# Altium schematic sheet USB Full Speed.SchDoc
size A3; Company Name: Renesas Electronics America; CompanyURL: www.renesas.com; PageSetup: Record=PageOptions|CenterHorizontal=True|CenterVertical=True|PrintScale=1.00|XCorrection=1.00|YCorrection=1.00|PrintKind=1|BorderSize=5000000|LeftOffset=0|BottomOffset=0|Orientation=2|PaperLength=1000|PaperWidth=1000|Scale=100|PaperSource=7|PrintQuality=-4|MediaType=1|DitherType=10|PaperKind=A5 148x210mm|PrintScaleMode=1; ReleaseDate: 16.09.2025; Version: MP; SPICEModelCache: <root> / <DocumentId>FGGANMHQ</DocumentId> / </root>; SheetNumber: 4; SheetTotal: 18; VariantNumber: 0; DSheetNumber: 1
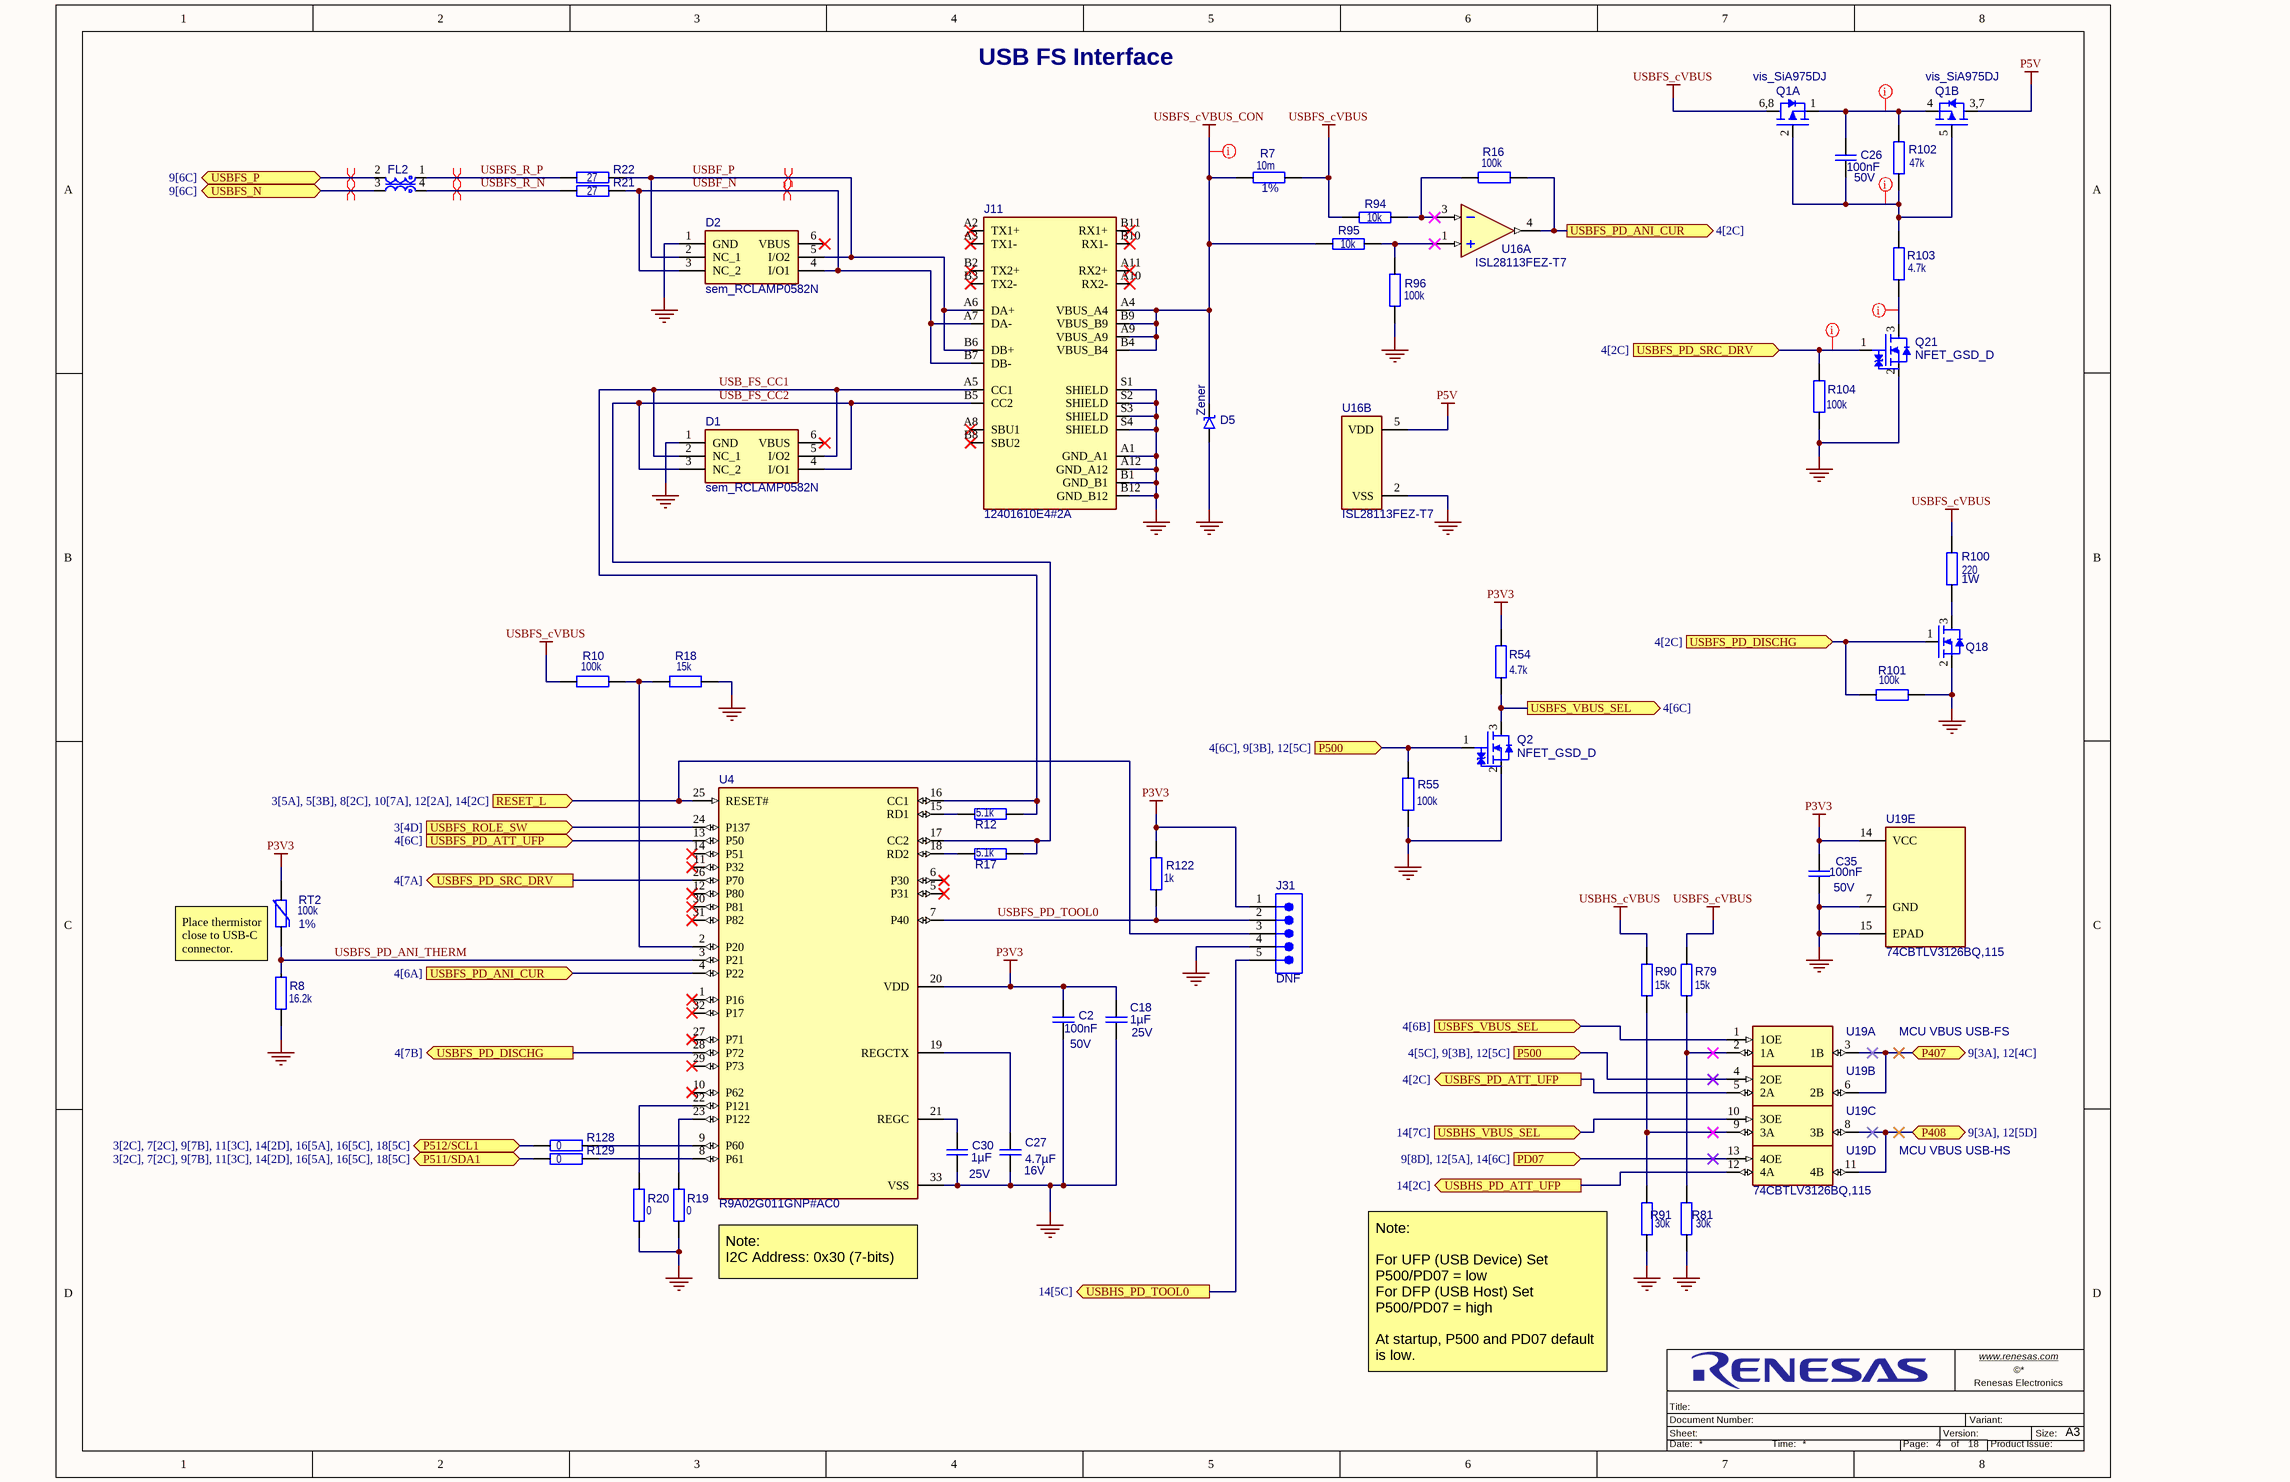
[diagram p0: USB Full Speed.SchDoc]

## Parts
C2  value 100nF  Operating Voltage Max: 50V  [C_EIA0402_0p55]  (hidden comment: Capacitor)
C18  value 1µF  Operating Voltage Max: 25V  [C_EIA0402_0p6]  (hidden comment: Capacitor)
C26  value 100nF  Operating Voltage Max: 50V  [C_EIA0402_0p55]  (hidden comment: Capacitor)
C27  value 4.7µF  Operating Voltage Max: 16V  [C_EIA0603_1p0]  (hidden comment: Capacitor)
C30  value 1µF  Operating Voltage Max: 25V  [C_EIA0402_0p6]  (hidden comment: Capacitor)
C35  value 100nF  Operating Voltage Max: 50V  [C_EIA0402_0p55]  (hidden comment: Capacitor)
D1  sem_RCLAMP0582N  [sem_SLP-6_SLP1210N6]
D2  sem_RCLAMP0582N  [sem_SLP-6_SLP1210N6]
D5  Zener  [sem_SGP-2_SGP1610N2]
FL2  CMC_1-2_4-3  [mur_EIA03025]  (value not drawn)
J11  12401610E4#2A  [amp_12401610E42A]
J31  CON_005  [wue_61300511121]  (value not drawn)
Q1  vis_SiA975DJ  [vis_SC70-6L_Dual]  (parts A,B of 2)
Q2  NFET_GSD_D  [roh_SOT-416FL_SC-89]
Q18  NFET_GSD  [ir_sot-23_3N]  (value not drawn)
Q21  NFET_GSD_D  [roh_SOT-416FL_SC-89]
R7  value 10m  Tolerance: 1%  [R_EIA0603]  (hidden comment: Resistor)
R8  value 16.2k  [R_EIA0402]  (hidden comment: Resistor)
R10  value 100k  [R_EIA0402]  (hidden comment: Resistor)
R12  value 5.1k  [R_EIA0402]  (hidden comment: Resistor)
R16  value 100k  [R_EIA0402]  (hidden comment: Resistor)
R17  value 5.1k  [R_EIA0402]  (hidden comment: Resistor)
R18  value 15k  [R_EIA0402]  (hidden comment: RC0402FR-0715KL)
R19  value 0  [R_EIA0402]  (hidden comment: Resistor)
R20  value 0  [R_EIA0402]  (hidden comment: Resistor)
R21  value 27  [R_EIA0402]  (hidden comment: Resistor)
R22  value 27  [R_EIA0402]  (hidden comment: Resistor)
R54  value 4.7k  [R_EIA0402]  (hidden comment: Resistor)
R55  value 100k  [R_EIA0402]  (hidden comment: Resistor)
R79  value 15k  [R_EIA0402]  (hidden comment: RC0402FR-0715KL)
R81  value 30k  [R_EIA0402]  (hidden comment: RC0402FR-0730KL)
R90  value 15k  [R_EIA0402]  (hidden comment: RC0402FR-0715KL)
R91  value 30k  [R_EIA0402]  (hidden comment: RC0402FR-0730KL)
R94  value 10k  [R_EIA0402]  (hidden comment: Resistor)
R95  value 10k  [R_EIA0402]  (hidden comment: Resistor)
R96  value 100k  [R_EIA0402]  (hidden comment: Resistor)
R100  value 220  Power: 1W  [R_EIA2512]  (hidden comment: Resistor)
R101  value 100k  [R_EIA0402]  (hidden comment: Resistor)
R102  value 47k  [R_EIA0402]  (hidden comment: Resistor)
R103  value 4.7k  [R_EIA0402]  (hidden comment: Resistor)
R104  value 100k  [R_EIA0402]  (hidden comment: Resistor)
R122  value 1k  [R_EIA0402]  (hidden comment: Resistor)
R128  value 0  [R_EIA0402]  (hidden comment: Resistor)
R129  value 0  [R_EIA0402]  (hidden comment: Resistor)
RT2  value 100k  Tolerance: 1%  [R_EIA0402]  (hidden comment: Thermistor)
U4  R9A02G011GNP#AC0  [ren_HVQFN-32_PVQN0032KG-A]
U16  ISL28113FEZ-T7  [ren_SC70-5_P5.049]  (parts A,B of 2)
U19  74CBTLV3126BQ,115  [nex_DHVQFN14_SOT-762-1_MO-241]  (value not drawn)  (parts A,B,C,D,E of 5)

## Ports
P407 (bidir, see 9[3A], 12[4C]), P408 (bidir, see 9[3A], 12[5D]), P500 (in, see 4[5C], 9[3B], 12[5C]), P500 (in, see 4[6C], 9[3B], 12[5C]), P511/SDA1 (bidir, see 3[2C], 7[2C], 9[7B], 11[3C], 14[2D], 16[5A], 16[5C], 18[5C]), P512/SCL1 (bidir, see 3[2C], 7[2C], 9[7B], 11[3C], 14[2D], 16[5A], 16[5C], 18[5C]), PD07 (in, see 9[8D], 12[5A], 14[6C]), RESET_L (in, see 3[5A], 5[3B], 8[2C], 10[7A], 12[2A], 14[2C]), USBFS_N (bidir, see 9[6C]), USBFS_P (bidir, see 9[6C]), USBFS_PD_ANI_CUR (in, see 4[6A]), USBFS_PD_ANI_CUR (out, see 4[2C]), USBFS_PD_ATT_UFP (in, see 4[6C]), USBFS_PD_ATT_UFP (out, see 4[2C]), USBFS_PD_DISCHG (in, see 4[2C]), USBFS_PD_DISCHG (out, see 4[7B]), USBFS_PD_SRC_DRV (in, see 4[2C]), USBFS_PD_SRC_DRV (out, see 4[7A]), USBFS_ROLE_SW (in, see 3[4D]), USBFS_VBUS_SEL (in, see 4[6B]), USBFS_VBUS_SEL (out, see 4[6C]), USBHS_PD_ATT_UFP (out, see 14[2C]), USBHS_PD_TOOL0 (out, see 14[5C]), USBHS_VBUS_SEL (in, see 14[7C])

## Nets
GND: C2.1 C18.2 C27.2 C30.1 C35.1 D1.1(GND) D2.1(GND) D5.2(A) J11.A1(GND_A1) J11.A12(GND_A12) J11.B1(GND_B1) J11.B12(GND_B12) J11.S1(SHIELD) J11.S2(SHIELD) J11.S3(SHIELD) J11.S4(SHIELD) J31.4 Q2.2(Source) Q18.2(Source) Q21.2(Source) R8.1 R18.1 R19.1 R20.1 R55.1 R81.1 R91.1 R96.1 R101.2 R104.1 U4.33(VSS) U16.2(VSS) U19.7(GND) U19.15(EPAD)
P3V3: C2.2 C18.1 C35.2 J31.1 R54.2 R122.2 RT2.2 U4.20(VDD) U19.14(VCC)
P5V: Q1.3,7(Drain2) U16.5(VDD)
USBFS_cVBUS: Q1.6,8(Drain1) R7.2 R10.1 R79.2 R94.1 R100.2
USBFS_cVBUS_CON: D5.1(K) J11.A4(VBUS_A4) J11.A9(VBUS_A9) J11.B4(VBUS_B4) J11.B9(VBUS_B9) R7.1 R95.1
USBHS_cVBUS: R90.2
P407: U19.3(1B) U19.6(2B) ; port P407
P408: U19.8(3B) U19.11(4B) ; port P408
P500: Q2.1(Gate) R55.2 U19.4(2OE) ; port P500
P511/SDA1: R129.2 ; port P511/SDA1
P512/SCL1: R128.2 ; port P512/SCL1
PD07: U19.13(4OE) ; port PD07
RESET_L: J31.3 U4.25(RESET#) ; port RESET_L
USB_FS_CC1: D1.2(NC_1) D1.5(I/O2) J11.A5(CC1) R12.2 U4.16(CC1)
USB_FS_CC2: D1.3(NC_2) D1.4(I/O1) J11.B5(CC2) R17.2 U4.17(CC2)
USBF_N: D2.3(NC_2) D2.4(I/O1) J11.A7(DA-) J11.B7(DB-) R21.2
USBF_P: D2.2(NC_1) D2.5(I/O2) J11.A6(DA+) J11.B6(DB+) R22.2
USBFS_N: FL2.3 ; port USBFS_N
USBFS_P: FL2.2 ; port USBFS_P
USBFS_PD_ANI_CUR: R16.2 U4.4(P22) U16.4(OUT) ; port USBFS_PD_ANI_CUR
USBFS_PD_ANI_THERM: R8.2 RT2.1 U4.3(P21)
USBFS_PD_ATT_UFP: U4.13(P50) U19.5(2A) ; port USBFS_PD_ATT_UFP
USBFS_PD_DISCHG: Q18.1(Gate) R101.1 U4.28(P72) ; port USBFS_PD_DISCHG
USBFS_PD_SRC_DRV: Q21.1(Gate) R104.2 U4.26(P70) ; port USBFS_PD_SRC_DRV
USBFS_PD_TOOL0: J31.2 R122.1 U4.7(P40)
USBFS_R_N: FL2.4 R21.1
USBFS_R_P: FL2.1 R22.1
USBFS_ROLE_SW: U4.24(P137) ; port USBFS_ROLE_SW
USBFS_VBUS_SEL: Q2.3(Drain) R54.1 U19.1(1OE) ; port USBFS_VBUS_SEL
USBHS_PD_ATT_UFP: U19.12(4A) ; port USBHS_PD_ATT_UFP
USBHS_PD_TOOL0: J31.5 ; port USBHS_PD_TOOL0
USBHS_VBUS_SEL: U19.10(3OE) ; port USBHS_VBUS_SEL
NetC26_1: C26.1 Q1.2(Gate1) Q1.5(Gate2) R102.1 R103.2
NetC26_2: C26.2 Q1.1(Source1) Q1.4(Source2) R102.2
NetC27_1: C27.1 U4.19(REGCTX)
NetC30_2: C30.2 U4.21(REGC)
NetQ18_3: Q18.3(Drain) R100.1
NetQ21_3: Q21.3(Drain) R103.1
NetR10_2: R10.2 R18.2 U4.2(P20)
NetR12_1: R12.1 U4.15(RD1)
NetR16_1: R16.1 R94.2 U16.3(IN-)
NetR17_1: R17.1 U4.18(RD2)
NetR19_2: R19.2 U4.23(P122)
NetR20_2: R20.2 U4.22(P121)
NetR79_1: R79.1 R81.2 U19.2(1A)
NetR90_1: R90.1 R91.2 U19.9(3A)
NetR95_2: R95.2 R96.2 U16.1(IN+)
NetR128_1: R128.1 U4.9(P60)
NetR129_1: R129.1 U4.8(P61)

Not connected (* = marked no-connect by the designer): D1 6(VBUS)*; D2 6(VBUS)*; J11 A2(TX1+)* A3(TX1-)* A8(SBU1)* A10(RX2-)* A11(RX2+)* B2(TX2+)* B3(TX2-)* B8(SBU2)* B10(RX1-)* B11(RX1+)*; U4 1(P16)* 5(P31)* 6(P30)* 10(P62)* 11(P32)* 12(P80)* 14(P51)* 27(P71)* 29(P73)* 30(P81)* 31(P82)* 32(P17)*

## Layout directives
differential pair; differential pair class USB: USBF_N, USBF_P, USBFS_N, USBFS_P, USBFS_R_N, USBFS_R_P
net class Power: NetC26_2
net class Power_Control: NetC26_1, NetQ21_3, USBFS_PD_SRC_DRV
net class Power; rule Supply Nets [Voltage = 5.000]: USBFS_cVBUS_CON

## Notes on the sheet
- USB FS Interface
- Place thermistor close to USB-C connector.
- MCU VBUS USB-FS
- MCU VBUS USB-HS
- Note:
  I2C Address: 0x30 (7-bits)
- (near R91) Note:
  For UFP (USB Device) Set P500/PD07 = low
  For DFP (USB Host) Set P500/PD07 = high
  At startup, P500 and PD07 default is low.
- www.renesas.com <http://www.renesas.com>
- Sheet:
- Title:
- Document Number:
- Version:
- Variant:
- Renesas Electronics
- Size:
- A3
- Date:
- Time:
- Page:
- of
- Product Issue:

## Library data of the parts
C2 C26 C35 = CAP-00003203-9: Capacitor,EIA0402,100n,50V,X7R; Tolerance: 10%; Qualification: AEC-Q200; Subtype: MLCC; Dielectric: X7R; Height: 550µm; Operating Temperature Max: 125°C; Operating Temperature Min: -55°C
C18 C30 = CAP-00000014-5: Capacitor,EIA0402,1u,25V,X6S; Tolerance: 10%; Qualification: AEC-Q200; Subtype: MLCC; Dielectric: X6S; Height: 600µm; Operating Temperature Max: 105°C; Operating Temperature Min: -55°C
C27 = CAP-00003210-8: Capacitor,EIA0603,4.7u,16V,X7S; Tolerance: 10%; Qualification: AEC-Q200; Subtype: MLCC; Dielectric: X7S; Height: 1mm; Operating Temperature Max: 125°C; Operating Temperature Min: -55°C
D1 D2 = DIO-00003463-14: Low Capacitance TVS Diode Array; Qualification: AEC-Q100; Reverse Voltage: 6.5V; Subtype: ESD; Height: 580µm; Operating Temperature Max: 125°C; Operating Temperature Min: -40°C
D5 = DIO-00000001-5: ESD Suppressor Diode TVS Uni-Dir 22V 55Vc Automotive 2-Pin SGP T/R; Qualification: AEC-Q100; Height: 550µm; Operating Temperature Max: 125°C; Operating Temperature Min: -40°C; Reverse Voltage: 22V; Subtype: ESD
FL2 = IND-00000004-4: Common Mode Choke / Filters, 90uH 25%, 0.1A, 3.8Ohm DCR; Current: 100mA; DC Resistance: 3.8; Frequency: 100MHz; Subtype: CMC; Value: 90; Tolerance: 25%; Height: 450mm; Operating Temperature Max: 85°C; Operating Temperature Min: -40°C; Qualification: -
J11 = CON-00000065-5: Connector USB 3.2 Gen2 Type C Horizontal SMD; Gender: female; Current: 5A; Operating Voltage Max: 20V; Pin Count: 24; Operating Temperature Max: 85°C; Qualification: -; Operating Temperature Min: -40°C; Height: 3.43mm
J31 = CON-00003286-13: Header,5way,1row,vertical,2.54mm,THT; Current: 3A; DC Resistance: 20m; Gender: male; Operating Voltage Max: 250V; Height: 8.89mm; Operating Temperature Max: 105°C; Operating Temperature Min: -40°C; Pin Count: 5; Qualification: -; DNF: DNF
Q1 = TRA-00000003-7: Dual P-Channel -12V -4.5A MOSFET; DC Resistance: 0.11; Gate Voltage Threshold Max: -1V; Gate Voltage Threshold Min: -400mV; Input Capacitance: 1.5nF; Power: 1.9W; Subtype: PMOS; Current: -4.5A; Operating Temperature Max: 150°C; Operating Temperature Min: -55°C; Operating Voltage Max: -12V; Pin Count: 6; Qualification: -
Q2 Q21 = TRA-00000001-2: N-Channel 60V 250mA Small Signal MOSFET; DC Resistance: 2.4; Gate Voltage Threshold Max: 2.3V; Gate Voltage Threshold Min: 1V; Input Capacitance: 15pF; Power: 150mW; Subtype: NMOS; Current: 250mA; Operating Temperature Max: 150°C; Operating Temperature Min: -55°C; Operating Voltage Max: 60V; Pin Count: 3; Qualification: -
Q18 = TRA-00000004-3: N-Channel 30V 5A 1.3W MOSFET; DC Resistance: 29m; Gate Voltage Threshold Max: 1.1V; Gate Voltage Threshold Min: 500mV; Input Capacitance: 650pF; Subtype: NMOS; Current: 5A; Operating Temperature Max: 150°C; Operating Temperature Min: -55°C; Operating Voltage Max: 30V; Pin Count: 3; Power: 1.3W; Qualification: -
R7 = RES-00003205-3: Resistor,EIA0603,10m,0.25W; Power: 250mW; Qualification: AEC-Q200; Subtype: Chip Resistor; Height: 700µm; Operating Temperature Max: 125°C; Operating Temperature Min: -55°C
R8 = RES-00001689-10: Resistor,EIA0402,16.2k,0.0625W; Power: 62.5mW; Tolerance: 1%; Subtype: Chip Resistor; Operating Temperature Max: 155°C; Operating Temperature Min: -55°C; Qualification: -
R10 R16 R55 R96 R101 R104 = RES-00000926-9: Resistor,EIA0402,100k,0.0625W; Power: 62.5mW; Tolerance: 1%; Subtype: Chip Resistor; Operating Temperature Max: 155°C; Operating Temperature Min: -55°C; Qualification: -
R12 R17 = RES-00000895-9: Resistor,EIA0402,5.1k,0.0625W; Power: 62.5mW; Tolerance: 1%; Subtype: Chip Resistor; Operating Temperature Max: 155°C; Operating Temperature Min: -55°C; Qualification: -
R18 R79 R90 = RES-00000906-9: Resistor,EIA0402,15k,0.0625W; Tolerance: 1%; Power: 62.5mW; Subtype: Chip Resistor; Operating Temperature Min: -55°C; Qualification: -; Operating Temperature Max: 155°C
R19 R20 R128 R129 = RES-00000801-9: Resistor,EIA0402,0,0.0625W; Power: 62.5mW; Tolerance: 5%; Subtype: Chip Resistor; Operating Temperature Max: 155°C; Operating Temperature Min: -55°C; Qualification: -
R21 R22 = RES-00000840-9: Resistor,EIA0402,27,0.0625W; Power: 62.5mW; Tolerance: 1%; Subtype: Chip Resistor; Operating Temperature Max: 155°C; Operating Temperature Min: -55°C; Qualification: -
R54 R103 = RES-00000894-9: Resistor,EIA0402,4.7k,0.0625W; Power: 62.5mW; Tolerance: 1%; Subtype: Chip Resistor; Operating Temperature Max: 155°C; Operating Temperature Min: -55°C; Qualification: -
R81 R91 = RES-00000913-9: Resistor,EIA0402,30k,0.0625W; Subtype: Chip Resistor; Tolerance: 1%; Power: 62.5mW; Qualification: -; Operating Temperature Min: -55°C; Operating Temperature Max: 155°C
R94 R95 = RES-00000902-9: Resistor,EIA0402,10k,0.0625W; Power: 62.5mW; Tolerance: 1%; Subtype: Chip Resistor; Operating Temperature Max: 155°C; Operating Temperature Min: -55°C; Qualification: -
R100 = RES-00003204-2: Resistor,EIA2512,220,1W; Tolerance: 1%; Operating Voltage Max: 200V; Qualification: AEC-Q100; Subtype: Chip Resistor; Height: 750µm; Operating Temperature Max: 155°C; Operating Temperature Min: -55°C; Temperature Coefficient: -
R102 = RES-00000918-9: Resistor,EIA0402,47k,0.0625W; Power: 62.5mW; Tolerance: 1%; Subtype: Chip Resistor; Operating Temperature Max: 155°C; Operating Temperature Min: -55°C; Qualification: -
R122 = RES-00000878-9: Resistor,EIA0402,1k,0.0625W; Power: 62.5mW; Tolerance: 1%; Subtype: Chip Resistor; Operating Temperature Max: 155°C; Operating Temperature Min: -55°C; Qualification: -
RT2 = RES-00000000-6: NTC Thermistor, R_EIA0402, 100K, 4250K; Operating Voltage Max: 5V; Power: 160µW; Height: 550µm; Operating Temperature Max: 125°C; Operating Temperature Min: -40°C; Qualification: -; Subtype: Thermistor
U4 = ICS-00000018-7: USB Power Delivery Controller, USB 3.1, HVQFN32; Frequency: 24MHz; Operating Voltage Max: 5.5V; Operating Voltage Min: 3V; Output Voltage Min: 0V; Subtype: Digital; Operating Temperature Max: 105°C; Operating Temperature Min: -40°C; Output Voltage Max: 5.5V; Pin Count: 33; Qualification: -
U16 = ICS-00000015-3: Single, General Purpose Micropower, RRIO Operational Amplifier; Frequency: 2MHz; Operating Voltage Max: 5.5V; Operating Voltage Min: 1.8V; Subtype: Power; Operating Temperature Max: 125°C; Operating Temperature Min: -40°C; Output Voltage Max: 5.5V; Pin Count: 5; Qualification: -
U19 = ICS-00000034-10: Bus Driver, 4-Func, 1-Bit, True Output, CMOS, DHVQN14, SOT762-1; Frequency: 406MHz; Subtype: Digital; Current: 100mA; Power: 500mW; Operating Voltage Min: 2.3V; Operating Voltage Max: 3.6V; Pin Count: 15; Operating Temperature Min: -40°C; Qualification: -; Operating Temperature Max: 125°C